# Altium schematic sheet MCU.SchDoc
size A4; SheetNumber: 3; SheetTotal: 3
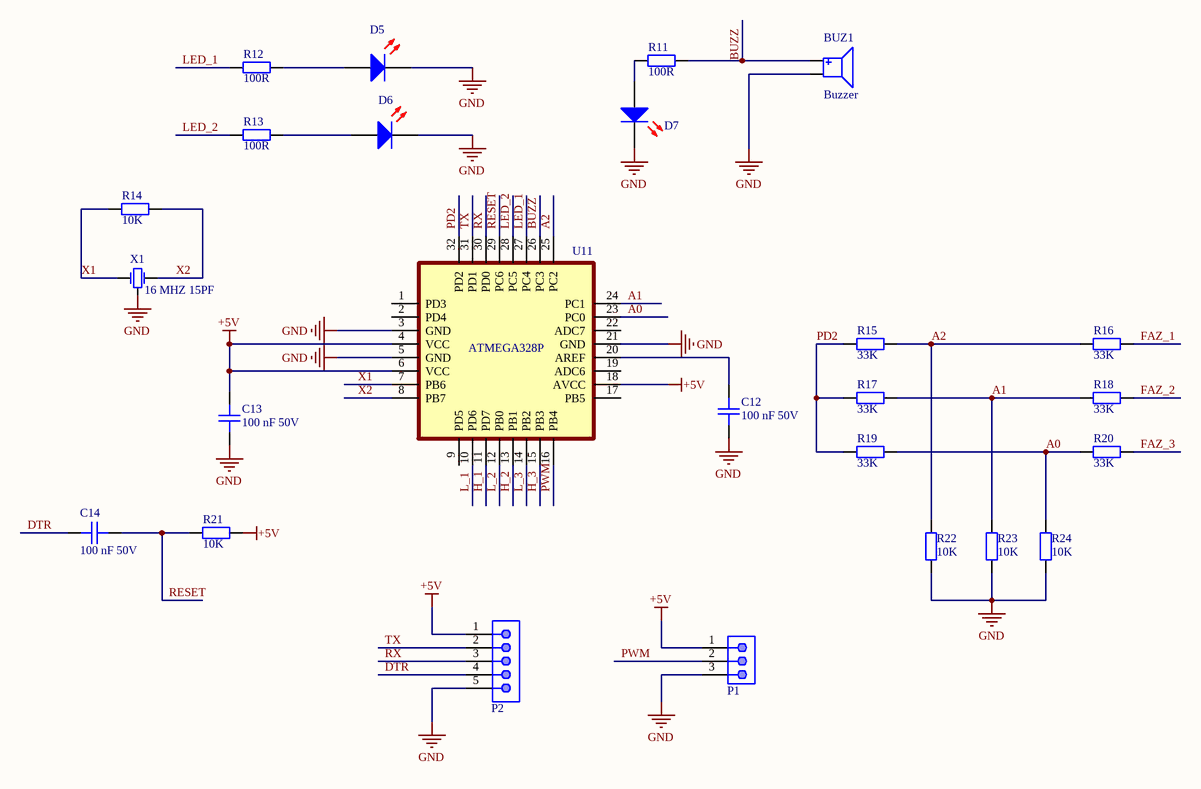
[diagram p0: MCU.SchDoc]

## Parts
BUZ1  Deger: Buzzer  [BUZ: CMT-7525]  (hidden comment: BUZZER MAGN 3.6V 7.5X7.5MM SMD)
C12  deger: 100 nF 50V  [CAP-0805(2012)]  (hidden comment: CAP CER 0.1UF 50V X7R 0805)
C13  deger: 100 nF 50V  [CAP-0805(2012)]  (hidden comment: CAP CER 0.1UF 50V X7R 0805)
C14  deger: 100 nF 50V  [CAP-0805(2012)]  (hidden comment: CAP CER 0.1UF 50V X7R 0805)
D5  Red 645nm LED Indication - Discrete 1.8V 0805  [SMD: LED 0805/2012 RED]  (value not drawn)
D6  Red 645nm LED Indication - Discrete 1.8V 0805  [SMD: LED 0805/2012 RED]  (value not drawn)
D7  Red 645nm LED Indication - Discrete 1.8V 0805  [SMD: LED 0805/2012 RED]  (value not drawn)
P1  WR-PHD 2.54 mm Angled Socket Header  [PWM_CONN]  (value not drawn)
P2  WR-PHD 2.54 mm Angled Socket Header  [TTL_CONN_5]  (value not drawn)
R11  Deger: 100R  [RES-0805]  (hidden comment: RES SMD 100 OHM 1% 1/8W 0805)
R12  Deger: 100R  [RES-0805]  (hidden comment: RES SMD 100 OHM 1% 1/8W 0805)
R13  Deger: 100R  [RES-0805]  (hidden comment: RES SMD 100 OHM 1% 1/8W 0805)
R14  Deger: 10K  [RES-0805]  (hidden comment: RES SMD 10K OHM 1% 1/8W 0805)
R15  Deger: 33K  [RES-0805]  (hidden comment: RES SMD 33K OHM 1% 1/8W 0805)
R16  Deger: 33K  [RES-0805]  (hidden comment: RES SMD 33K OHM 1% 1/8W 0805)
R17  Deger: 33K  [RES-0805]  (hidden comment: RES SMD 33K OHM 1% 1/8W 0805)
R18  Deger: 33K  [RES-0805]  (hidden comment: RES SMD 33K OHM 1% 1/8W 0805)
R19  Deger: 33K  [RES-0805]  (hidden comment: RES SMD 33K OHM 1% 1/8W 0805)
R20  Deger: 33K  [RES-0805]  (hidden comment: RES SMD 33K OHM 1% 1/8W 0805)
R21  Deger: 10K  [RES-0805]  (hidden comment: RES SMD 10K OHM 1% 1/8W 0805)
R22  Deger: 10K  [RES-0805]  (hidden comment: RES SMD 10K OHM 1% 1/8W 0805)
R23  Deger: 10K  [RES-0805]  (hidden comment: RES SMD 10K OHM 1% 1/8W 0805)
R24  Deger: 10K  [RES-0805]  (hidden comment: RES SMD 10K OHM 1% 1/8W 0805)
U11  IC MCU 8BIT 32KB FLASH 32TQFP  [TQFP32]  (value not drawn)
X1  Deger: 16 MHZ 15PF  [CRYSTAL_16MHZ(CTSE16)]  (hidden comment: CERAMIC RES 16.0000MHZ 15PF SMD)

## Nets
+5V: C13.2 P1.1 P2.1 R21.2 U11.4(VCC) U11.6(VCC) U11.18(AVCC)
GND: BUZ1.2(Negative) C12.1 C13.1 D5.2(K) D6.2(K) D7.2(K) P1.3 P2.5 R22.1 R23.1 R24.1 U11.3(GND) U11.5(GND) U11.21(GND) X1.2(GND)
A0: R19.2 R20.1 R24.2 U11.23(PC0)
A1: R17.2 R18.1 R23.2 U11.24(PC1)
A2: R15.2 R16.1 R22.2 U11.25(PC2)
BUZZ: BUZ1.1(Positive) R11.2 U11.26(PC3)
DTR: C14.1 P2.4
FAZ_1: R16.2
FAZ_2: R18.2
FAZ_3: R20.2
H_1: U11.11(PD7)
H_2: U11.13(PB1)
H_3: U11.15(PB3)
L_1: U11.10(PD6)
L_2: U11.12(PB0)
L_3: U11.14(PB2)
LED_1: R12.1 U11.27(PC4)
LED_2: R13.1 U11.28(PC5)
PD2: R15.1 R17.1 R19.1 U11.32(PD2)
PWM: P1.2 U11.16(PB4)
RESET: C14.2 R21.1 U11.29(PC6)
RX: P2.3 U11.30(PD0)
TX: P2.2 U11.31(PD1)
X1: R14.1 U11.7(PB6) X1.1(OSC1)
X2: R14.2 U11.8(PB7) X1.3(OSC2)
NetC12_2: C12.2 U11.20(AREF)
NetD5_1: D5.1(A) R12.2
NetD6_1: D6.1(A) R13.2
NetD7_1: D7.1(A) R11.1

Not connected (* = marked no-connect by the designer): U11 1(PD3) 2(PD4) 9(PD5) 17(PB5) 19(ADC6) 22(ADC7)

## Library data of the parts
BUZ1 = Buzzer(CMT-7525-80-SMT-TR): Buzzers Transducer, Externally Driven Magnetic 3.6V 100mA 2.73kHz 80dB @ 3.6V, 10cm Surface Mount Solder Pads; Kılıf: Nonstandard; -Sicaklik: -40; +Sicaklik: +85; Cins: Buzzer; Uretici Kodu: CMT-7525-80-SMT-TR; MSL: 1 (Unlimited); Lehim Yöntemi: SMD
C12-C14 = 100nF 50V 0805: 0.1 µF ±10% 50V Ceramic Capacitor X7R 0805 (2012 Metric); üretici kodu: CL21B104KBCNNNC; sıcaklık +: +125; sıcaklık -: -55; kılıf: 0805; cins: kondansatör; lehim yöntemi: smd; MSL: 1 (Unlimited)
D5-D7 = LED_Kırmızı: LED RED DIFFUSED 0805 SMD; Uretici Kodu: LH R974-LP-1; Kılıf: 0805; -Sicaklik: -40; +Sicaklik: +125; Deger: KIRMIZI LED; Cins: LED; Lehim Yöntemi: SMD; MSL: 1 (Unlimited)
P1 = HDR(1X3): Cins: Konnektor; Uretici Kodu: 613003143121; Kılıf: 3POS 2.54MM; -Sicaklik: -40; +Sicaklik: +105; Lehim Yöntemi: MANUEL; MSL: 1 (Unlimited)
P2 = HDR(1X5): Cins: Konnektor; Uretici Kodu: 613005143121; Kılıf: 5POS 2.54MM; -Sicaklik: -40; +Sicaklik: +105; Lehim Yöntemi: MANUEL; MSL: 1 (Unlimited)
R11-R13 = 100R 0805: 100 Ohms ±1% 0.125W, 1/8W Chip Resistor 0805 (2012 Metric) Moisture Resistant Thick Film; Cins: Direnc; Uretici Kodu: RC0805FR-07100RL; Kılıf: 0805; -Sicaklik: -55; +Sicaklik: +155; Lehim Yöntemi: SMD; MSL: 1 (Unlimited)
R14 R21-R24 = 10K 0805: 10 kOhms ±1% 0.125W, 1/8W Chip Resistor 0805 (2012 Metric) Moisture Resistant Thick Film; Cins: Direnc; Kılıf: 0805; Uretici Kodu: RC0805FR-0710KL; -Sicaklik: -55; +Sicaklik: +155; Lehim Yöntemi: SMD; MSL: 1 (Unlimited)
R15-R20 = 33K 0805: 33 kOhms ±1% 0.125W, 1/8W Chip Resistor 0805 (2012 Metric) Moisture Resistant Thick Film; Cins: Direnc; Kılıf: 0805; -Sicaklik: -55; +Sicaklik: +155; Uretici Kodu: RC0805FR-0733KL; MSL: 1 (Unlimited); Lehim Yöntemi: SMD
U11 = ATMEGA328P: AVR AVR® ATmega Microcontroller IC 8-Bit 20MHz 32KB (16K x 16) FLASH 32-TQFP (7x7); sıcaklık-: -40; Sıcaklık+: +85; Üretici Kodu: ATMEGA328P-AUR; lehim yöntemi: SMD; MSL: 3 (168 Hours); kılıf: TQFP32; cins: IC; deger: ATMEGA328P
X1 = CRYSTAL 16.0000MHZ(CSTCE16M0V53-R0): 16MHz Ceramic Resonator Built in Capacitor 15pF ±0.3%  -20°C ~ 80°C Surface Mount; Cins: Kristal; Kılıf: 3-SMD; -Sicaklik: -20; +Sicaklik: +80; Uretici Kodu: CSTCE16M0V53-R0; Lehim Yöntemi: SMD; MSL: 1 (Unlimited)